# Altium schematic sheet tie-flash-cfg.SchDoc: Copper Suicide - Net Tie - Flash
size Letter; CheckedBy: E. Chiu; CompanyName: Signal Laboratories, Inc.; DrawnBy: J. Brinton; Engineer: J. Brinton; Address1: 3479 Edison Way; Address2: Menlo Park CA 94025; Address3: +1 (877) 778-8435; Address4: siglabs.com; Revision: 1; SheetNumber: 22; SheetTotal: 44
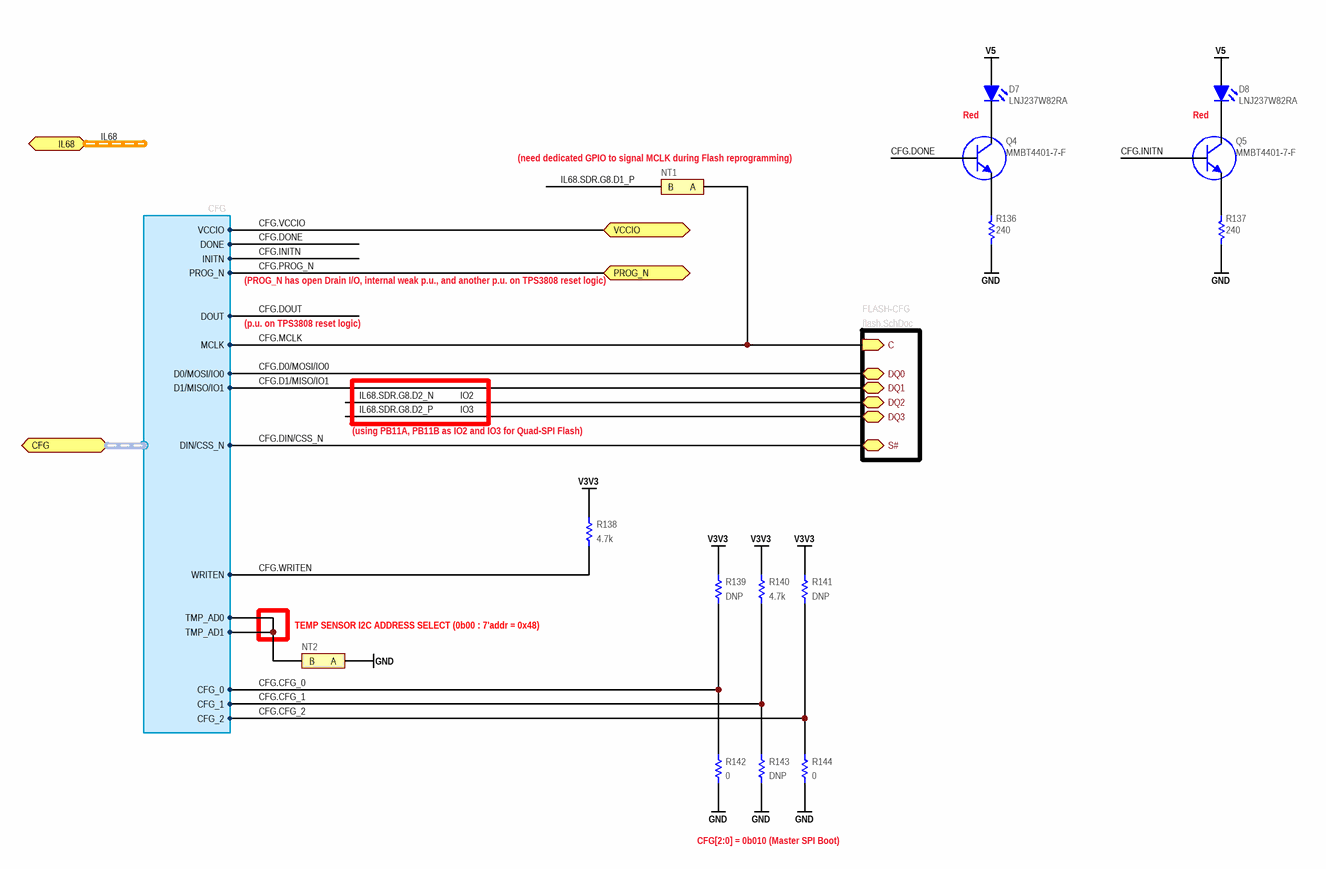
[diagram p0: tie-flash-cfg.SchDoc]

## Parts
D7  LNJ237W82RA  [0603_LED]
D8  LNJ237W82RA  [0603_LED]
NT1  NET_TIE  [NET_TIE]  (value not drawn)  (net tie, no BOM)
NT2  NET_TIE  [NET_TIE]  (value not drawn)  (net tie, no BOM)
Q4  MMBT4401-7-F  [SOT23]
Q5  MMBT4401-7-F  [SOT23]
R136  value 240  [RESC1005X40N]  (hidden comment: ERJ-2RKF2400X)
R137  value 240  [RESC1005X40N]  (hidden comment: ERJ-2RKF2400X)
R138  value 4.7k  [RESC1005X40N]  (hidden comment: ERJ-2RKF4701X)
R139  Do Not Place: DNP  [RESC1608X55N]  (hidden comment: ERJ-3EKF4701V)
R140  value 4.7k  [RESC1608X55N]  (hidden comment: ERJ-3EKF4701V)
R141  Do Not Place: DNP  [RESC1608X55N]  (hidden comment: ERJ-3EKF4701V)
R142  value 0  [RESC1608X55N]  (hidden comment: ERJ-3GEY0R00V)
R143  Do Not Place: DNP  [RESC1608X55N]  (hidden comment: ERJ-3GEY0R00V)
R144  value 0  [RESC1608X55N]  (hidden comment: ERJ-3GEY0R00V)

## Sub-sheets
FLASH-CFG = flash.SchDoc: C (in), DQ0 (bidir), DQ1 (bidir), DQ2 (bidir), DQ3 (bidir), S# (bidir)

## Ports
CFG (harness CFG), IL68 (harness IL), PROG_N (bidir), VCCIO

## Harnesses
CFG: MCLK, D1/MISO/IO1, D0/MOSI/IO0, DIN/CSS_N, DOUT, PROG_N, DONE, INITN, VCCIO, CFG_0, CFG_1, CFG_2, WRITEN, TMP_AD0, TMP_AD1

## Nets
GND: NT2.A R136.2 R137.2 R142.1 R143.1 R144.1
V3V3: R138.2 R139.2 R140.2 R141.2
V5: D7.1(A) D8.1(A)
CFG.CFG_0: R139.1 R142.2 ; port CFG.CFG_0
CFG.CFG_1: R140.1 R143.2 ; port CFG.CFG_1
CFG.CFG_2: R141.1 R144.2 ; port CFG.CFG_2
CFG.D0/MOSI/IO0: sheet FLASH-CFG/DQ0, port CFG.D0/MOSI/IO0
CFG.D1/MISO/IO1: sheet FLASH-CFG/DQ1, port CFG.D1/MISO/IO1
CFG.DIN/CSS_N: sheet FLASH-CFG/S#, port CFG.DIN/CSS_N
CFG.DONE: Q4.1(B) ; port CFG.DONE
CFG.DOUT: port CFG.DOUT
CFG.INITN: Q5.1(B) ; port CFG.INITN
CFG.MCLK: NT1.A ; sheet FLASH-CFG/C, port CFG.MCLK
CFG.PROG_N: port PROG_N, port CFG.PROG_N
CFG.VCCIO: port VCCIO, port CFG.VCCIO
CFG.WRITEN: R138.1 ; port CFG.WRITEN
IL68.SDR.G8.D1_P: NT1.B
IL68.SDR.G8.D2_N: sheet FLASH-CFG/DQ2  [also labelled IO2]
IL68.SDR.G8.D2_P: sheet FLASH-CFG/DQ3  [also labelled IO3]
NetD7_2: D7.2(K) Q4.3(C)
NetD8_2: D8.2(K) Q5.3(C)
NetNT2_B: NT2.B ; port CFG.TMP_AD0, port CFG.TMP_AD1
NetQ4_2: Q4.2(E) R136.1
NetQ5_2: Q5.2(E) R137.1

## Buses and harness runs
harness IL68 = port IL68

## Notes on the sheet
- (near NT1) (need dedicated GPIO to signal MCLK during Flash reprogramming)
- Red
- (p.u. on TPS3808 reset logic)
- (PROG_N has open Drain I/O, internal weak p.u., and another p.u. on TPS3808 reset logic)
- (using PB11A, PB11B as IO2 and IO3 for Quad-SPI Flash)
- (near NT2) TEMP SENSOR I2C ADDRESS SELECT (0b00 : 7'addr = 0x48)
- CFG[2:0] = 0b010 (Master SPI Boot)
- Title
- Engineer
- Revision
- Drawn By
- Checked By
- Date
- Sheet
- of

## Library data of the parts
D7 D8 = LED0603RD: LED, SMT 0603, Color Red, 5mA, 1.85V; Manufacturer: Panasonic; Manufacturer P/N: LNJ237W82RA; Package: 0603 Polarized
Q4 Q5 = MMBT4401-7-F: NPN Small Signal Transistor SMD SOT-23; Manufacturer: Diodes, Inc.; Manufacturer P/N: MMBT4401-7-F
R136 R137 = RES: Thick Film Resistor 240 ±1% 0.1W 75V 0402; Manufacturer: Panasonic; Tcr: ±100; Tr: -55:155; Voltage: 75; Power: 0.1; Tolerance: ±1%; Manufacturer P/N: ERJ-2RKF2400X; Alternatives: *; Footprint: *; Package: 0402
R138 = RES: Thick Film Resistor 4.7k ±1% 0.1W 75V 0402; Manufacturer: Panasonic; Tcr: ±100; Tr: -55:155; Voltage: 75; Power: 0.1; Tolerance: ±1%; Manufacturer P/N: ERJ-2RKF4701X; Alternatives: *; Footprint: *; Package: 0402
R139-R141 = RES: Thick Film Resistor 4.7k ±1% 0.1W 50V 0603; Manufacturer: Panasonic; Tcr: ±100; Tr: -55:155; Voltage: 75; Power: 0.1; Tolerance: ±1%; Manufacturer P/N: ERJ-3EKF4701V; Alternatives: *; Footprint: *; Package: 0603
  R139 R141: Value: 4.7k
R142 R144 = RES: Thick Film Resistor Jumper 0 1A 0603; Manufacturer: Panasonic; Tcr: ±100; Tolerance: ±1%; Tr: -55:155; Voltage: 75; Power: 0.1; Manufacturer P/N: ERJ-3GEY0R00V; Alternatives: *; Footprint: *; Package: 0402
R143 = RES: Thick Film Resistor Jumper 0 1A 0603; Manufacturer: Panasonic; Tcr: ±100; Tolerance: ±1%; Tr: -55:155; Voltage: 75; Power: 0.1; Value: 0; Manufacturer P/N: ERJ-3GEY0R00V; Alternatives: *; Footprint: *; Package: 0402